# EAGLE design ControlDCMotors (EAGLE 6.6.0)
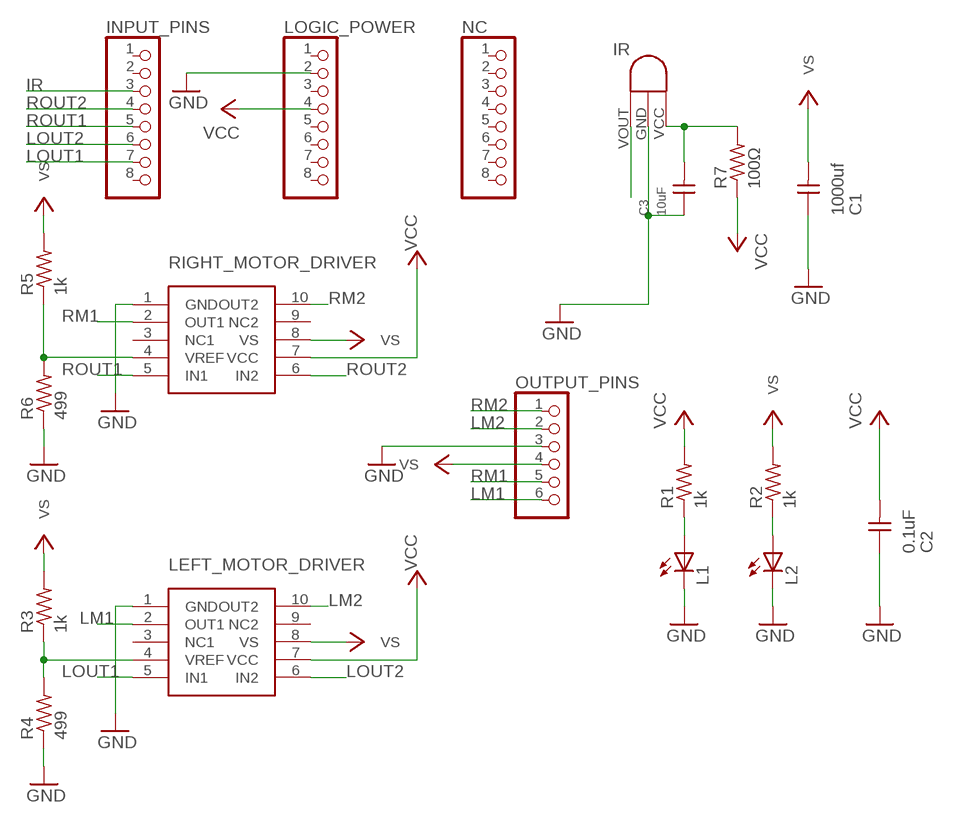
[diagram p0: schematic, sheet 1]

## Parts
C1  1000uf  EPOL5_10.5  [EPOL5_10.5]
C2  0.1uF  C1206  [1206]
C3  10uF  C1206  [1206]
INPUT_PINS  PINHD-1X8  [1X08]
IR_SENSOR  IR_SENSOR  [IR_SENSOR]
L1  LED1608  [LED1608]
L2  LED1608  [LED1608]
LEFT_MOTOR_DRIVER  TA7291P  [HSIP10_P_2.54]
LOGIC_POWER  PINHD-1X8  [1X08]
NC  PINHD-1X8  [1X08]
OUTPUT_PINS  PINHD-1X6  [1X06]
R1  1k  R1206  [1206]
R2  1k  R1206  [1206]
R3  1k  R1206  [1206]
R4  499  R1206  [1206]
R5  1k  R1206  [1206]
R6  499  R1206  [1206]
R7  100Ω  R1206  [1206]
RIGHT_MOTOR_DRIVER  TA7291P  [HSIP10_P_2.54]

## Nets
GND: C1.- C2.1 C3.1 IR_SENSOR.GND L1.C L2.C LEFT_MOTOR_DRIVER.1(GND) LOGIC_POWER.2 OUTPUT_PINS.3 R4.1 R6.1 RIGHT_MOTOR_DRIVER.1(GND)
IR: INPUT_PINS.3 IR_SENSOR.VOUT
LM1: LEFT_MOTOR_DRIVER.2(OUT1) OUTPUT_PINS.6
LM2: LEFT_MOTOR_DRIVER.10(OUT2) OUTPUT_PINS.2
LOUT1: INPUT_PINS.7 LEFT_MOTOR_DRIVER.5(IN1)
LOUT2: INPUT_PINS.6 LEFT_MOTOR_DRIVER.6(IN2)
N$1: L1.A R1.1
N$2: L2.A R2.1
N$3: R5.1 R6.2 RIGHT_MOTOR_DRIVER.4(VREF)
N$4: LEFT_MOTOR_DRIVER.4(VREF) R3.1 R4.2
N$5: C3.2 IR_SENSOR.VCC R7.2
RM1: OUTPUT_PINS.5 RIGHT_MOTOR_DRIVER.2(OUT1)
RM2: OUTPUT_PINS.1 RIGHT_MOTOR_DRIVER.10(OUT2)
ROUT1: INPUT_PINS.5 RIGHT_MOTOR_DRIVER.5(IN1)
ROUT2: INPUT_PINS.4 RIGHT_MOTOR_DRIVER.6(IN2)
VCC: C2.2 LEFT_MOTOR_DRIVER.7(VCC) LOGIC_POWER.4 R1.2 R7.1 RIGHT_MOTOR_DRIVER.7(VCC)
VS: C1.+ LEFT_MOTOR_DRIVER.8(VS) OUTPUT_PINS.4 R2.2 R3.2 R5.2 RIGHT_MOTOR_DRIVER.8(VS)
Unconnected: INPUT_PINS.1 INPUT_PINS.2 INPUT_PINS.8 LEFT_MOTOR_DRIVER.3(NC1) LEFT_MOTOR_DRIVER.9(NC2) LOGIC_POWER.1 LOGIC_POWER.3 LOGIC_POWER.5 LOGIC_POWER.6 LOGIC_POWER.7 LOGIC_POWER.8 NC.1 NC.2 NC.3 NC.4 NC.5 NC.6 NC.7 NC.8 RIGHT_MOTOR_DRIVER.3(NC1) RIGHT_MOTOR_DRIVER.9(NC2)

## Library data of the parts
C1 = FABLAB_Kamakura:EPOL5_10.5
C2 C3 = FABLAB_Kamakura:C1206
INPUT_PINS LOGIC_POWER NC = pinhead:PINHD-1X8: PIN HEADER
IR_SENSOR = FABLAB_Kamakura:IR_SENSOR
L1 L2 = FABLAB_Kamakura:LED1608
LEFT_MOTOR_DRIVER RIGHT_MOTOR_DRIVER = FABLAB_Kamakura:TA7291P
OUTPUT_PINS = pinhead:PINHD-1X6: PIN HEADER
R1-R7 = FABLAB_Kamakura:R1206

## Board
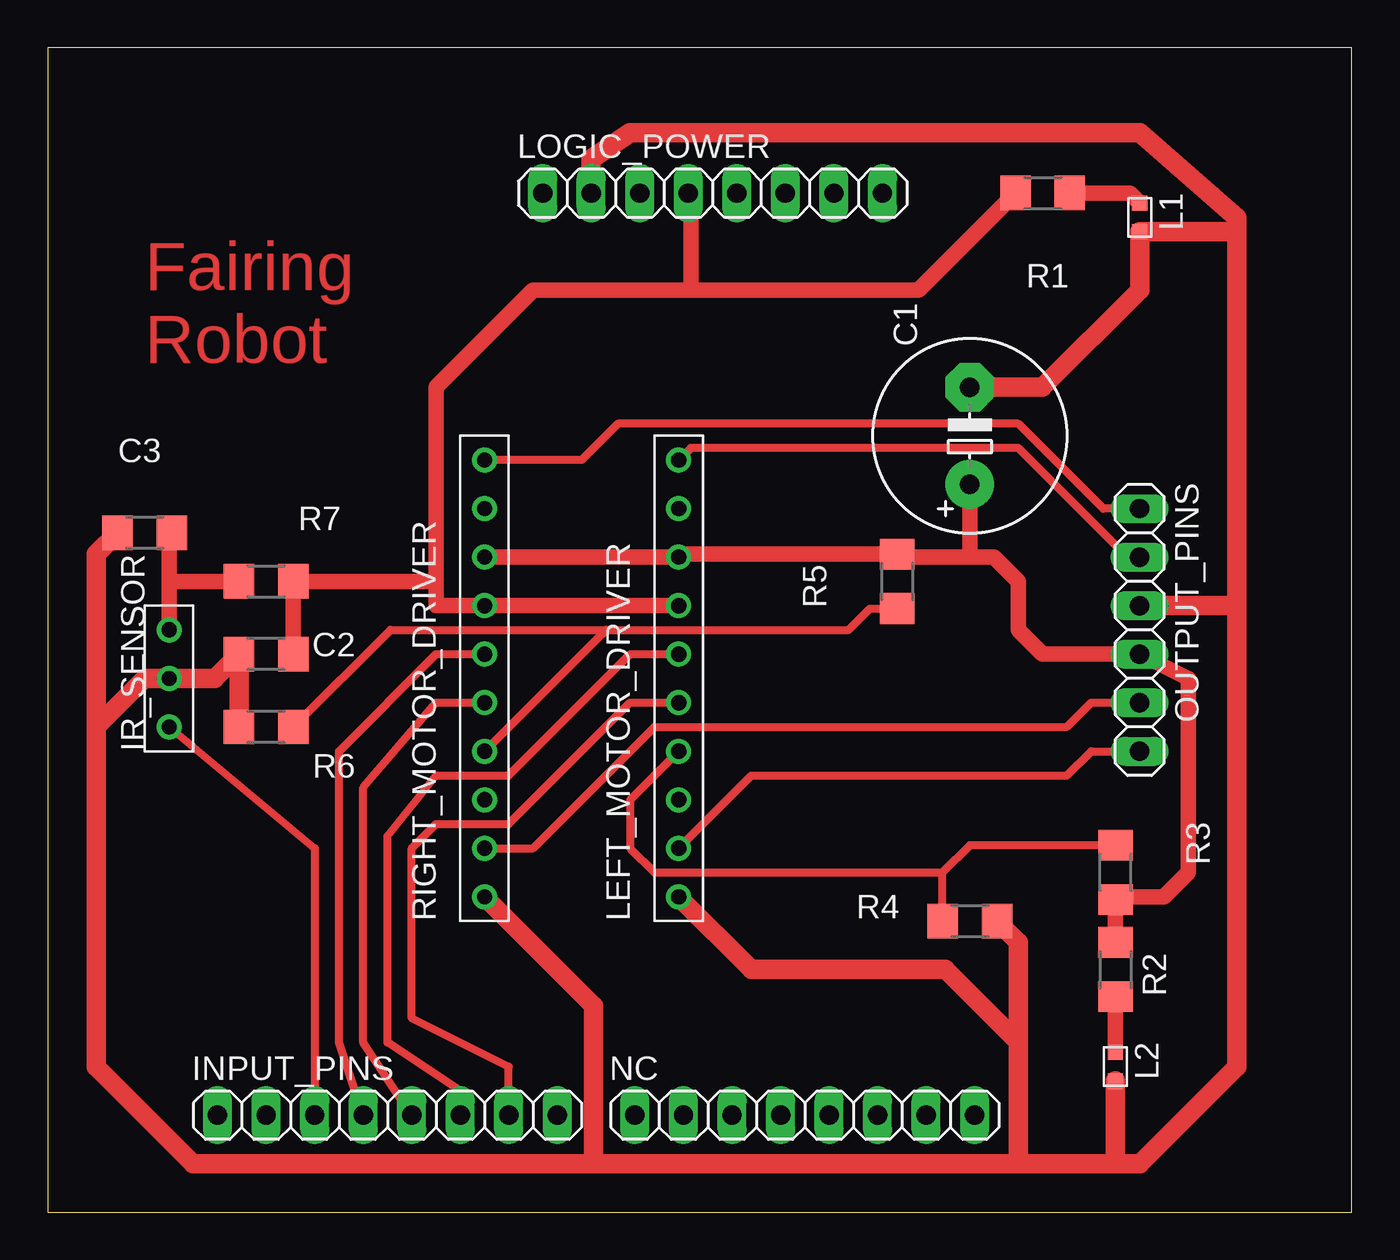
[diagram p1: board, top side]

Size 68.25 x 60.95 mm. Coordinates in mm from the lower left corner, seen from the top.
Outline: 0,0 68.25,0 68.25,60.95 0,60.95 0,0
Copper layers (1*16): Top 0.035mm / dielectric 1.5mm / Bottom 0.035mm
Design rules "default *": minimum track width 10mil, minimum drill 24mil, track to track 0.4mm, track to pad 0.4mm, pad to pad 0.4mm, via to via 0.4mm, smd to smd 0.4mm, copper to edge 40mil, drill to drill 8mil, minimum pad ring 10mil, minimum via ring 8mil, stop-mask expansion 4mil, vias tented up to drill 0mil, thermal gap 10mil

### Footprints (pad centres in the part's own frame; a part is rotated, then mirrored left to right if it is on the bottom)
EPOL5_10.5 = drill 1.016 pad 2.54: + -2.54,0 | drill 1.016 pad 2.54 octagon: - 2.54,0
1206 = smd 1.6 x 1.803: 1 -1.422,0; 2 1.422,0
1X08 = drill 1.016 long: 1 -8.89,0; 2 -6.35,0; 3 -3.81,0; 4 -1.27,0; 5 1.27,0; 6 3.81,0; 7 6.35,0; 8 8.89,0
IR_SENSOR = drill 0.8: GND 0,0; VCC 2.54,0; VOUT -2.54,0
LED1608 = smd 0.8 x 0.8: A -0.75,0; C 0.75,0
HSIP10_P_2.54 = drill 0.8: 1 -11.43,0; 2 -8.89,0; 3 -6.35,0; 4 -3.81,0; 5 -1.27,0; 6 1.27,0; 7 3.81,0; 8 6.35,0; 9 8.89,0; 10 11.43,0
1X06 = drill 1.016 long: 1 -6.35,0; 2 -3.81,0; 3 -1.27,0; 4 1.27,0; 5 3.81,0; 6 6.35,0

### Placement (x,y rotation side)
C1  48.26,40.64 90 top
C2  11.43,29.21 0 top
C3  5.08,35.56 0 top
INPUT_PINS  17.78,5.08 0 top
IR_SENSOR  6.35,27.94 90 top
L1  57.15,52.07 270 top
L2  55.88,7.62 270 top
LEFT_MOTOR_DRIVER  33.02,27.94 90 top
LOGIC_POWER  34.8,53.34 0 top
NC  39.62,5.08 0 top
OUTPUT_PINS  57.15,30.48 270 top
R1  52.07,53.34 180 top
R2  55.88,12.7 90 top
R3  55.88,17.78 270 top
R4  48.26,15.24 180 top
R5  44.45,33.02 90 top
R6  11.43,25.4 0 top
R7  11.43,33.02 180 top
RIGHT_MOTOR_DRIVER  22.86,27.94 90 top

### Tracks (layer width: path | path; a pad name or v marks a point on that pad's centre or on a via)
GND
  Top 0.406: 27.94,2.54 28.57,3.17
  Top 0.813: 62.23,51.32 62.23,50.8
  Top 1.016: LOGIC_POWER.2 28.45,55.12 30.48,56.52 57.15,56.52 62.23,52.07 62.23,50.8 62.23,31.75 | 62.23,31.75 62.23,7.62 57.15,2.54 55.88,2.54 | 55.88,2.54 50.8,2.54 | 50.8,2.54 27.94,2.54 7.62,2.54 2.54,7.62 2.54,25.4 | RIGHT_MOTOR_DRIVER.1 28.57,10.79 28.57,3.17 | LEFT_MOTOR_DRIVER.1 36.83,12.7 46.99,12.7 50.8,8.89 | 50.8,8.89 50.8,2.54 | R4.1 50.8,14.12 50.8,8.89 | 2.54,25.4 5.08,27.94 IR_SENSOR.GND 8.74,27.94 C2.1 R6.1 | OUTPUT_PINS.3 62.23,31.75 | C3.1 2.54,34.44 2.54,25.4 | 62.23,51.32 L1.C 57.15,48.26 52.07,43.18 C1.- | L2.C 55.88,2.54
IR
  Top 0.406: IR_SENSOR.VOUT 13.97,19.05 INPUT_PINS.3
LM1
  Top 0.406: LEFT_MOTOR_DRIVER.2 36.83,22.86 53.34,22.86 54.61,24.13 OUTPUT_PINS.6
LM2
  Top 0.406: OUTPUT_PINS.2 56.52,34.29 50.8,40.01 33.66,40.01 LEFT_MOTOR_DRIVER.10
LOUT1
  Top 0.406: INPUT_PINS.7 24.13,7.62 19.05,10.16 19.05,19.05 20.32,20.32 24.13,20.32 30.48,26.67 LEFT_MOTOR_DRIVER.5
LOUT2
  Top 0.406: INPUT_PINS.6 21.59,6.35 17.78,8.89 17.78,19.68 20.32,22.86 24.13,22.86 30.48,29.21 LEFT_MOTOR_DRIVER.6
N$1
  Top 0.406: R1.1 53.82,53.34
  Top 0.813: 53.82,53.34 56.63,53.34 L1.A
N$2
  Top 0.813: R2.1 L2.A
N$3
  Top 0.406: RIGHT_MOTOR_DRIVER.4 29.21,30.48 | 29.21,30.48 41.91,30.48 43.03,31.6 R5.1 | R6.2 17.93,30.48 29.21,30.48
N$4
  Top 0.406: R4.2 46.84,17.78 | LEFT_MOTOR_DRIVER.4 30.48,21.59 30.48,19.05 31.75,17.78 46.84,17.78 | R3.1 48.26,19.2 46.84,17.78
N$5
  Top 0.813: 6.5,30.63 IR_SENSOR.VCC 6.35,33.02 | 6.35,35.41 6.35,33.02 | R7.2 6.35,33.02
  Top 1.016: C3.2 6.35,35.41
RM1
  Top 0.406: RIGHT_MOTOR_DRIVER.2 25.4,19.05 31.75,25.4 53.34,25.4 54.61,26.67 OUTPUT_PINS.5
RM2
  Top 0.406: OUTPUT_PINS.1 55.24,36.83 50.8,41.27 29.84,41.27 27.94,39.37 RIGHT_MOTOR_DRIVER.10
ROUT1
  Top 0.406: INPUT_PINS.5 16.51,8.89 16.51,22.23 20.32,26.67 RIGHT_MOTOR_DRIVER.5
ROUT2
  Top 0.406: INPUT_PINS.4 15.24,8.89 15.24,24.13 20.32,29.21 RIGHT_MOTOR_DRIVER.6
VCC
  Top 0.406: LOGIC_POWER.4 33.66,53.21
  Top 0.813: LEFT_MOTOR_DRIVER.7 RIGHT_MOTOR_DRIVER.7 20.32,31.75 20.32,33.02 | 20.32,33.02 20.32,43.18 25.4,48.26 33.66,48.26 | R1.2 45.57,48.26 33.66,48.26 | 33.66,53.21 33.66,48.26 | 20.32,33.02 R7.1 C2.2
VS
  Top 0.406: LEFT_MOTOR_DRIVER.8 33.17,34.44 | R5.2 44.6,34.29 | 56.03,16.51 R3.2
  Top 0.813: RIGHT_MOTOR_DRIVER.8 LEFT_MOTOR_DRIVER.8 | 48.26,34.29 49.53,34.29 50.8,33.02 50.8,30.48 52.07,29.21 OUTPUT_PINS.4 59.69,27.94 59.69,17.78 58.42,16.51 56.03,16.51 | C1.+ 48.26,34.29 | 33.17,34.44 R5.2 | 44.6,34.29 48.26,34.29 | R2.2 R3.2

### Text on the board
Top: Fairing | Robot